# EAGLE design openv4a (EAGLE 9.5.1)
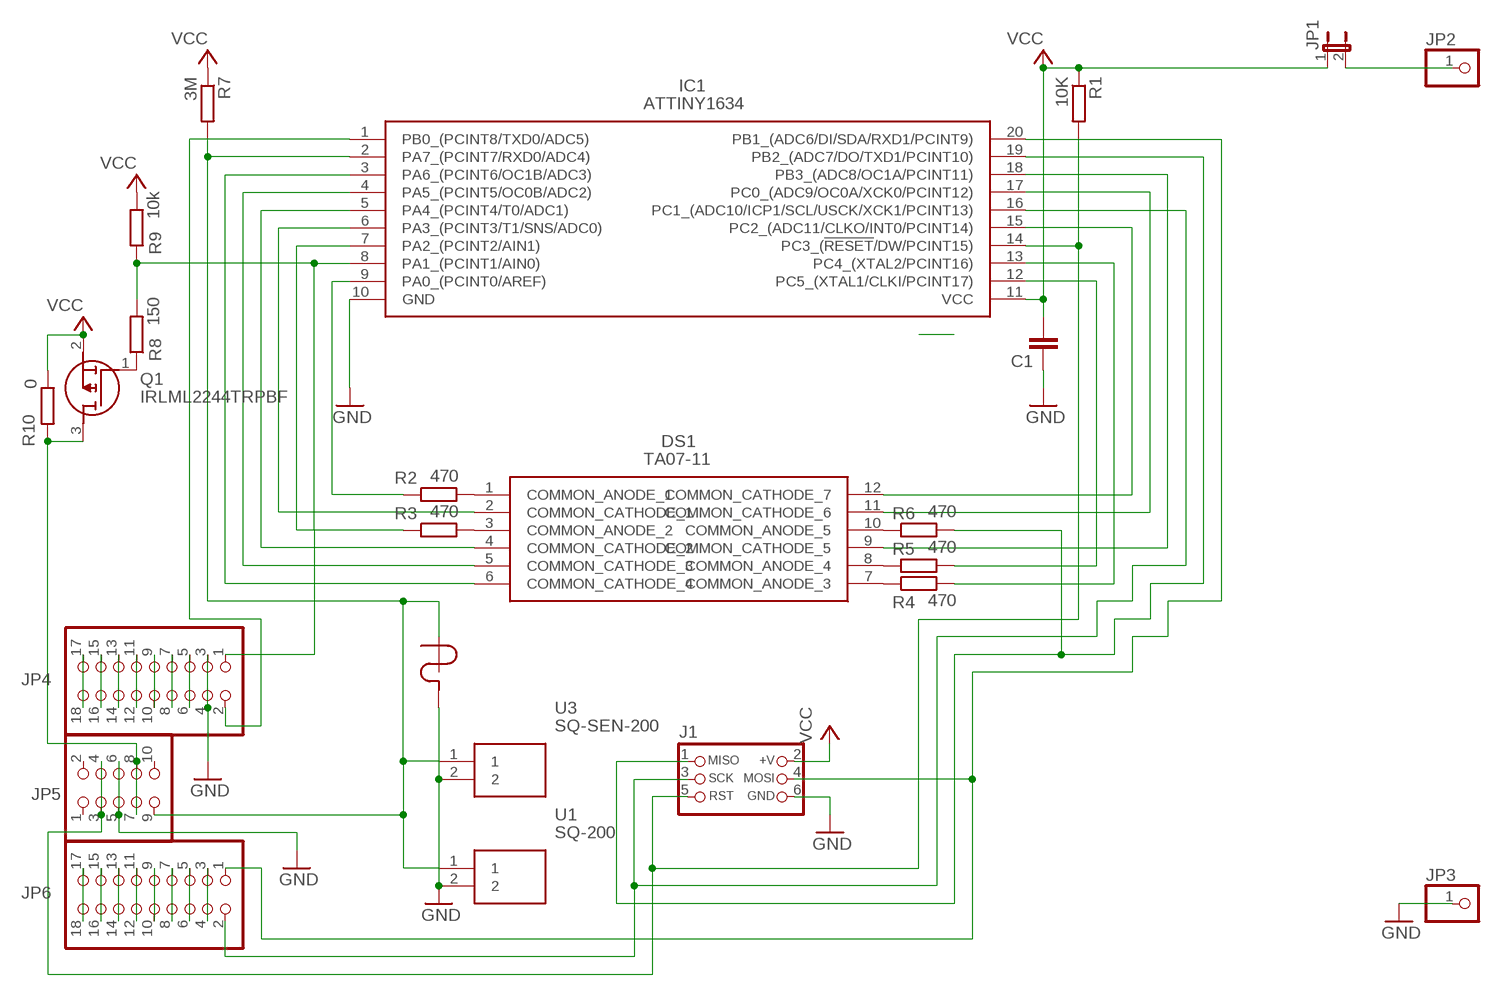
[diagram p0: schematic, sheet 1]

## Parts
C1  100nF  C-EUC0805  [C0805]
DS1  TA07-11  TA07-11EWA  [DIPS762W75P254L1778H665Q12N]
IC1  ATTINY1634  ATTINY1634R-SU  [SOIC127P1032X265-20N]
J1  CON_HEADER_PRG_AVR_ICSP-PTH  [HEADER_PRG_2X03]
JP1  JP1E  [JP1]
JP2  PINHD-1X1  [1X01]
JP3  PINHD-1X1  [1X01]
JP4  PINHD-2X9  [2X09]
JP5  PINHD-2X5  [2X05]
JP6  PINHD-2X9  [2X09]
Q1  IRLML2244TRPBF  [SOT95P237X112-3N]
R1  10K  R-EU_R0805  [R0805]
R2  470  R-EU_R0805  [R0805]
R3  470  R-EU_R0805  [R0805]
R4  470  R-EU_R0805  [R0805]
R5  470  R-EU_R0805  [R0805]
R6  470  R-EU_R0805  [R0805]
R7  3M  R-EU_R0805  [R0805]
R8  150  R-EU_R0805  [R0805]
R9  10k  R-EU_R0805  [R0805]
R10  0  R-EU_R0805  [R0805]
U1  SQ-200  SQ-MIN-200  [SQMIN200]
U2  VIB-SENS  VIBRATION-SENSOR-SIDE  [SW-18010P]
U3  SQ-SEN-200  [SQSEN200]

## Nets
GND: C1.1 IC1.10(GND) J1.6(GND) JP3.1 JP4.3 JP4.4 JP5.5 JP5.6 U1.2 U2.1 U3.2
N$2: IC1.1(PB0_(PCINT8/TXD0/ADC5)) JP4.2
N$3: JP1.2 JP2.1
N$4: DS1.1(COMMON_ANODE_1) R2.2
N$5: DS1.3(COMMON_ANODE_2) R3.2
N$6: DS1.7(COMMON_ANODE_3) R4.1
N$7: DS1.8(COMMON_ANODE_4) R5.1
N$8: DS1.10(COMMON_ANODE_5) R6.1
N$9: IC1.9(PA0_(PCINT0/AREF)) R2.1
N$10: IC1.8(PA1_(PCINT1/AIN0)) JP4.1 R8.2 R9.1
N$11: IC1.7(PA2_(PCINT2/AIN1)) R3.1
N$12: IC1.12(PC5_(XTAL1/CLKI/PCINT17)) R5.2
N$13: IC1.13(PC4_(XTAL2/PCINT16)) R4.2
N$14: DS1.2(COMMON_CATHODE_1) IC1.6(PA3_(PCINT3/T1/SNS/ADC0))
N$15: DS1.4(COMMON_CATHODE_2) IC1.5(PA4_(PCINT4/T0/ADC1))
N$16: DS1.5(COMMON_CATHODE_3) IC1.4(PA5_(PCINT5/OC0B/ADC2))
N$17: DS1.6(COMMON_CATHODE_4) IC1.3(PA6_(PCINT6/OC1B/ADC3))
N$18: IC1.19(PB2_(ADC7/DO/TXD1/PCINT10)) J1.1(MISO) R6.2
N$19: JP4.5 JP4.6
N$20: JP4.7 JP4.8
N$21: JP4.9 JP4.10
N$22: JP4.11 JP4.12
N$23: JP4.13 JP4.14
N$24: JP4.15 JP4.16
N$25: JP4.17 JP4.18
N$26: JP6.3 JP6.4
N$27: JP6.5 JP6.6
N$28: JP6.7 JP6.8
N$29: JP6.9 JP6.10
N$30: JP6.11 JP6.12
N$31: JP6.13 JP6.14
N$32: JP6.15 JP6.16
N$33: JP6.17 JP6.18
N$34: DS1.12(COMMON_CATHODE_7) IC1.15(PC2_(ADC11/CLKO/INT0/PCINT14))
N$35: DS1.11(COMMON_CATHODE_6) IC1.17(PC0_(ADC9/OC0A/XCK0/PCINT12))
N$37: IC1.16(PC1_(ADC10/ICP1/SCL/USCK/XCK1/PCINT13)) J1.3(SCK) JP6.2
N$38: Q1.1(G) R8.1
N$39: IC1.20(PB1_(ADC6/DI/SDA/RXD1/PCINT9)) J1.4(MOSI) JP6.1
N$40: DS1.9(COMMON_CATHODE_5) IC1.18(PB3_(ADC8/OC1A/PCINT11))
N$41: IC1.2(PA7_(PCINT7/RXD0/ADC4)) JP5.9 R7.2 U1.1 U2.2 U3.1
N$42: IC1.14(PC3_(!RESET!/DW/PCINT15)) J1.5(RST) JP5.3 JP5.4 R1.2
N$44: JP5.7 JP5.8 Q1.3(D) R10.2
VCC: C1.2 IC1.11(VCC) J1.2(+V) JP1.1 Q1.2(S) R1.1 R7.1 R9.2 R10.1
Unconnected: JP5.1 JP5.2 JP5.10

## Library data of the parts
C1 = rcl:C-EU: CAPACITOR, European symbol
DS1 = TA07-11EWA:TA07-11EWA: Kingbright TA07 LED-Anzeige Punktmatrix, 7 x 5 Punkte, Rot, Zeichenhhe 17.2mm 8,2 mcd 5 x 7 627 nm Source: Datasheet <http://www.kingbrightusa.com/images/catalog/SPEC/TA07-11EWA.pdf>; DESCRIPTION: Kingbright TA07 LED-Anzeige Punktmatrix, 7 x 5 Punkte, Rot, Zeichenhhe 17.2mm 8,2 mcd 5 x 7 627 nm; HEIGHT: 6.65mm; MANUFACTURER_NAME: Kingbright; MANUFACTURER_PART_NUMBER: TA07-11; MOUSER_PART_NUMBER: 604-TA07-11EWA; MOUSER_PRICE-STOCK: https://www.mouser.co.uk/ProductDetail/Kingbright/TA07-11EWA?qs=58z0TXQGVSTE7HMwS%2Fsauw%3D%3D
IC1 = ATTINY1634R-SU:ATTINY1634R-SU: Microchip ATTINY1634R-SU, 8bit AVR Microcontroller, 12MHz, 16 kB, 256 B Flash, 20-Pin SOIC Source: Datasheet <http://ww1.microchip.com/downloads/en/DeviceDoc/Atmel-8303-8-bit-AVR-Microcontroller-tinyAVR-ATtiny1634_Datasheet.pdf>; ARROW_PART_NUMBER: ATTINY1634R-SU; ARROW_PRICE-STOCK: https://www.arrow.com/en/products/attiny1634r-su/microchip-technology; DESCRIPTION: Microchip ATTINY1634R-SU, 8bit AVR Microcontroller, 12MHz, 16 kB, 256 B Flash, 20-Pin SOIC; HEIGHT: 2.65mm; MANUFACTURER_NAME: Microchip; MANUFACTURER_PART_NUMBER: ATTINY1634R-SU; MOUSER_PART_NUMBER: 556-ATTINY1634R-SU; MOUSER_PRICE-STOCK: https://www.mouser.co.uk/ProductDetail/Microchip-Technology-Atmel/ATTINY1634R-SU/?qs=TI%2F9gtmDCEGadIEQCaBqpA%3D%3D
J1 = dp_devices:CON_HEADER_PRG_AVR_ICSP: 2x3 AVR ICSP programming header
JP1 = jumper:JP1E: JUMPER
JP2 JP3 = pinhead:PINHD-1X1: PIN HEADER
JP4 JP6 = pinhead:PINHD-2X9: PIN HEADER
JP5 = pinhead:PINHD-2X5: PIN HEADER
Q1 = IRLML2244TRPBF:IRLML2244TRPBF: INFINEON - IRLML2244TRPBF - P CHANNEL POWER MOSFET, HEXFET, -20V, -4.3A, SOT-23 Source: Datasheet; DESCRIPTION: INFINEON - IRLML2244TRPBF - P CHANNEL POWER MOSFET, HEXFET, -20V, -4.3A, SOT-23; HEIGHT: 1.12mm; MANUFACTURER_NAME: Infineon; MANUFACTURER_PART_NUMBER: IRLML2244TRPBF; MOUSER_PART_NUMBER: 942-IRLML2244TRPBF; MOUSER_PRICE-STOCK: https://www.mouser.co.uk/ProductDetail/Infineon-IR/IRLML2244TRPBF/?qs=9%252BKlkBgLFf2tCL30qYbaQQ%3D%3D
R1-R10 = rcl:R-EU_: RESISTOR, European symbol
U1 = SQ-MIN-200:SQ-MIN-200: NANO-POWER TILT AND VIBRATION SENSOR Source: Datasheet <https://signalquest.com/download/Tilt and Vibration Sensor SQ-MIN-200.pdf>; DESCRIPTION: NANO-POWER TILT AND VIBRATION SENSOR; HEIGHT: 2.05mm; MANUFACTURER_NAME: SignalQuest; MANUFACTURER_PART_NUMBER: SQ-MIN-200
U2 = Supernode-Sensors:VIBRATION-SENSOR
U3 = SQ-SEN-200:SQ-SEN-200: NANO-POWER TILT AND VIBRATION SENSOR Source: Datasheet <https://signalquest.com/product/components/sq-sen-200/>; DESCRIPTION: NANO-POWER TILT AND VIBRATION SENSOR; HEIGHT: 3.4mm; MANUFACTURER_NAME: SignalQuest; MANUFACTURER_PART_NUMBER: SQ-SEN-200

## Board
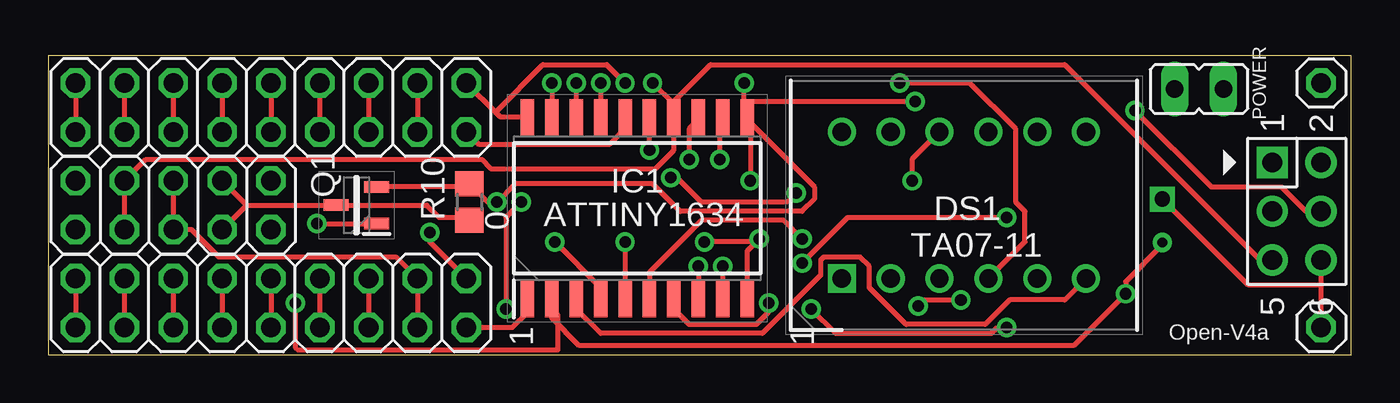
[diagram p1: board, top side]
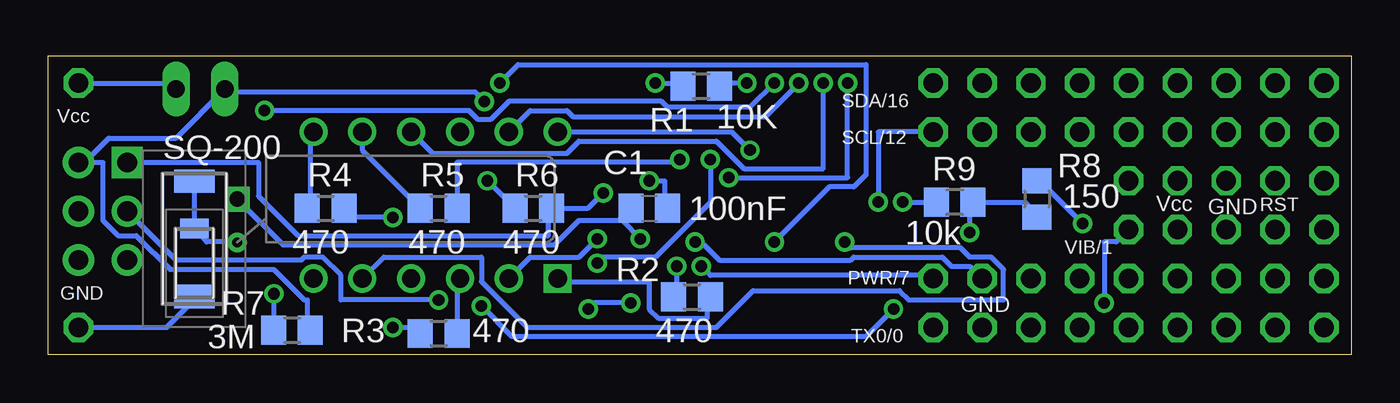
[diagram p2: board, bottom side, seen from below]

Size 67.77 x 15.55 mm. Coordinates in mm from the lower left corner, seen from the top.
Outline: 0,0 67.77,0 67.77,15.55 0,15.55 0,0
Copper layers (1*16): Top 0.035mm / dielectric 1.5mm / Bottom 0.035mm
Design rules "default *": minimum track width 10mil, minimum drill 0.6mm, track to track 8mil, track to pad 8mil, pad to pad 8mil, via to via 8mil, smd to smd 8mil, copper to edge 5mil, drill to drill 8mil, minimum pad ring 10mil, minimum via ring 8mil, stop-mask expansion 4mil, vias tented up to drill 0mil, thermal gap 10mil

### Footprints (pad centres in the part's own frame; a part is rotated, then mirrored left to right if it is on the bottom)
C0805 = smd 1.3 x 1.5: 1 -0.95,0; 2 0.95,0
DIPS762W75P254L1778H665Q12N = drill 0.95 pad 1.425 square: 1 0,0 | drill 0.95 pad 1.425: 2 0,-2.54; 3 0,-5.08; 4 0,-7.62; 5 0,-10.16; 6 0,-12.7; 7 7.62,-12.7; 8 7.62,-10.16; 9 7.62,-7.62; 10 7.62,-5.08; 11 7.62,-2.54; 12 7.62,0
SOIC127P1032X265-20N = smd 1.925 x 0.7: 1 -4.712,5.715; 2 -4.712,4.445; 3 -4.712,3.175; 4 -4.712,1.905; 5 -4.712,0.635; 6 -4.712,-0.635; 7 -4.712,-1.905; 8 -4.712,-3.175; 9 -4.712,-4.445; 10 -4.712,-5.715; 11 4.712,-5.715; 12 4.712,-4.445; 13 4.712,-3.175; 14 4.712,-1.905; 15 4.712,-0.635; 16 4.712,0.635; 17 4.712,1.905; 18 4.712,3.175; 19 4.712,4.445; 20 4.712,5.715
HEADER_PRG_2X03 = drill 1.02 pad 1.632 square: 1 -2.54,-1.27 | drill 1.02 pad 1.632: 2 -2.54,1.27; 3 0,-1.27; 4 0,1.27; 5 2.54,-1.27; 6 2.54,1.27
JP1 = drill 0.914 long: 1 0,-1.27; 2 0,1.27
1X01 = drill 1.016 octagon: 1 0,0
2X09 = drill 1.016 octagon: 1 -10.16,-1.27; 2 -10.16,1.27; 3 -7.62,-1.27; 4 -7.62,1.27; 5 -5.08,-1.27; 6 -5.08,1.27; 7 -2.54,-1.27; 8 -2.54,1.27; 9 0,-1.27; 10 0,1.27; 11 2.54,-1.27; 12 2.54,1.27; 13 5.08,-1.27; 14 5.08,1.27; 15 7.62,-1.27; 16 7.62,1.27; 17 10.16,-1.27; 18 10.16,1.27
2X05 = drill 1.016 octagon: 1 -5.08,-1.27; 2 -5.08,1.27; 3 -2.54,-1.27; 4 -2.54,1.27; 5 0,-1.27; 6 0,1.27; 7 2.54,-1.27; 8 2.54,1.27; 9 5.08,-1.27; 10 5.08,1.27
SOT95P237X112-3N = smd 1.3 x 0.6: 1 -1.05,0.95; 2 -1.05,-0.95; 3 1.05,0
R0805 = smd 1.3 x 1.5: 1 -0.95,0; 2 0.95,0
SQMIN200 = smd 1 x 1.5: 1 -1.8,0; 2 1.8,0
SW-18010P = drill 0.8 square: 1 0,0 | drill 0.5: 2 2.25,0
SQSEN200 = smd 1.2 x 2.1: 1 -3,0; 2 3,0

### Placement (x,y rotation side)
C1  36.51,7.62 0 bottom
DS1  41.27,3.97 90 top
IC1  30.64,7.62 90 top
J1  64.93,7.46 270 top
JP1  59.85,13.81 270 top
JP2  66.2,14.13 0 top
JP3  66.2,1.43 0 top
JP4  11.59,2.7 180 top
JP5  6.51,7.78 0 top
JP6  11.59,12.86 180 top
Q1  16.03,7.78 180 top
R1  33.81,13.97 0 bottom
R2  34.29,3.02 0 bottom
R3  47.47,1.11 0 bottom
R4  53.34,7.62 0 bottom
R5  47.47,7.62 0 bottom
R6  42.54,7.62 0 bottom
R7  55.09,1.27 180 bottom
R8  16.35,8.1 270 bottom
R9  20.64,7.94 180 bottom
R10  21.91,7.94 270 top
U1  60.17,4.76 270 bottom
U2  57.94,8.1 270 bottom
U3  60.17,6.03 270 bottom

### Tracks (layer width: path | path; a pad name or v marks a point on that pad's centre or on a via)
GND  (via drill 0.6)
  Top 0.254: JP5.6 JP5.5 7.46,6.51 8.89,5.08 18.1,5.08 JP4.3 JP4.4 | JP3.1 66.2,3.65 | 66.2,3.65 J1.6 | IC1.10 36.35,3.02 36.35,5.4 v36.99,6.03 36.67,5.87 v34.13,5.87 | 66.2,3.65 62.39,3.65 U2.1
  Bottom 0.254: U3.2 60.17,3.02 U1.2 60.17,2.86 61.59,1.43 JP3.1 | U2.1 55.56,5.71 41.43,5.71 40.16,6.98 38.1,6.98 C1.1 37.94,6.98 v36.99,6.03 | JP4.3 19.84,4.6 20.8,4.6 21.27,5.08 25.88,5.08 26.03,4.92 32.86,4.92 33.81,5.87 v34.13,5.87
N$2
  Top 0.254: JP4.2 24.13,1.43 24.92,2.22 24.92,2.86 IC1.1
N$3
  Bottom 0.254: JP1.2 61.44,14.13 JP2.1
N$4
  Bottom 0.254: DS1.1 41.12,3.81 36.51,3.81 36.51,2.38 36.04,1.9 33.5,1.9 33.5,3.02 R2.2
N$5
  Bottom 0.254: DS1.3 46.51,3.97 R3.2
N$6
  Bottom 0.254: DS1.7 54.13,11.59 54.13,7.62 R4.1
N$7
  Bottom 0.254: DS1.8 51.43,10.64 R5.1
N$8  (via drill 0.6)
  Top 0.254: v44.93,9.05 44.93,10.16 DS1.10
  Bottom 0.254: v44.93,9.05 R6.1
N$9  (via drill 0.6)
  Top 0.254: v35.08,4.6 35.08,3.02 IC1.9
  Bottom 0.254: v35.08,4.6 35.08,3.02 R2.1
N$10  (via drill 0.6)
  Top 0.254: v33.81,4.6 33.81,3.02 IC1.8 | v19.84,6.35 19.84,5.87 JP4.1
  Bottom 0.254: R8.2 16.35,7.3 16.99,7.94 R9.1 19.84,7.94 v19.84,6.35 | v33.81,4.6 33.34,4.13 21.91,4.13 JP4.1
N$11  (via drill 0.6)
  Top 0.254: v49.85,1.43 49.37,1.43 49.05,1.11 40.96,1.11 v39.69,2.38 | v37.46,2.7 37.46,2.22 36.83,1.59 33.34,1.59 32.54,2.38 32.54,2.86 IC1.7
  Bottom 0.254: v49.85,1.43 48.74,1.43 R3.1 | v39.69,2.38 39.37,2.7 v37.46,2.7
N$12  (via drill 0.6)
  Top 0.254: v34.92,10.16 34.92,12.06 35.08,12.22 IC1.12
  Bottom 0.254: v34.92,10.16 35.08,10 46.51,10 R5.2
N$13  (via drill 0.6)
  Top 0.254: v49.85,7.14 41.59,7.14 v39.21,4.76 | v33.34,10.16 33.34,11.75 33.81,12.22 IC1.13
  Bottom 0.254: v49.85,7.14 51.91,7.14 R4.2 | v39.21,4.76 38.89,5.08 36.19,5.08 33.34,7.94 v33.34,10.16
N$14  (via drill 0.6)
  Top 0.254: v39.21,6.03 38.26,6.98 33.97,6.98 31.27,4.29 31.27,3.02 IC1.6
  Bottom 0.254: v39.21,6.03 40.16,5.08 42.7,5.08 DS1.2
N$15  (via drill 0.6)
  Top 0.254: v30,5.87 30,3.02 IC1.5 | v44.29,14.13 47.94,14.13 50.32,11.75 50.32,7.94 50.8,7.46 50.8,5.87 DS1.4
  Bottom 0.254: v30,5.87 27.15,8.73 25.88,8.73 25.24,9.37 25.24,15.08 43.34,15.08 v44.29,14.13
N$16  (via drill 0.6)
  Top 0.254: v26.35,5.87 28.73,3.49 28.73,3.02 IC1.4
  Bottom 0.254: v26.35,5.87 26.03,5.56 20.32,5.56 19.84,5.08 18.73,5.08 18.1,4.44 18.1,2.86 23.02,2.86 23.49,3.33 31.11,3.33 33.02,1.43 42.86,1.43 45.24,3.81 45.24,5.08 50.32,5.08 DS1.5
N$17
  Top 0.254: DS1.6 52.86,2.86 50.01,2.86 48.74,1.59 44.61,1.59 42.7,3.49 42.7,4.6 42.23,5.08 40.32,5.08 40.16,4.92 40.16,4.13 37.15,1.11 28.73,1.11 27.46,2.38 27.46,2.86 IC1.3
N$18  (via drill 0.6)
  Top 0.254: v26.19,14.13 26.19,12.38 IC1.19 | v32.38,9.21 32.7,9.21 33.97,7.94 38.42,7.94 v38.89,8.41
  Bottom 0.254: J1.1 56.83,10 56.83,8.25 54.77,6.19 41.75,6.19 41.75,7.62 R6.2 39.69,7.62 v38.89,8.41 | v26.19,14.13 26.19,9.21 v32.38,9.21
N$19
  Top 0.254: JP4.5 JP4.6
N$20
  Top 0.254: JP4.7 JP4.8
N$21
  Top 0.254: JP4.9 JP4.10
N$22
  Top 0.254: JP4.11 JP4.12
N$23
  Top 0.254: JP4.13 JP4.14
N$24
  Top 0.254: JP4.15 JP4.16
N$25
  Top 0.254: JP4.17 JP4.18
N$26
  Top 0.254: JP6.3 JP6.4
N$27
  Top 0.254: JP6.5 JP6.6
N$28
  Top 0.254: JP6.7 JP6.8
N$29
  Top 0.254: JP6.9 JP6.10
N$30
  Top 0.254: JP6.11 JP6.12
N$31
  Top 0.254: JP6.13 JP6.14
N$32
  Top 0.254: JP6.15 JP6.16
N$33
  Top 0.254: JP6.17 JP6.18
N$34  (via drill 0.6)
  Top 0.254: v31.27,10.64 31.27,12.22 IC1.15
  Bottom 0.254: v31.27,10.64 32.23,11.59 DS1.12
N$35  (via drill 0.6)
  Top 0.254: v28.73,14.13 28.73,12.38 IC1.17
  Bottom 0.254: v28.73,14.13 30.48,12.38 40.48,12.38 40.8,12.7 42.7,12.7 DS1.11
N$37  (via drill 0.6)
  Top 0.254: JP6.2 22.38,10.95 29.21,10.95 30,11.75 30,12.22 IC1.16 | v47.47,2.86 45.56,2.86 v45.24,2.54 | v23.81,2.38 23.81,7.14 v24.61,7.94
  Bottom 0.254: J1.3 61.12,4.92 54.61,4.92 54.45,5.08 53.5,5.08 52.55,4.13 52.55,2.86 v47.47,2.86 | v45.24,2.54 43.66,0.95 25.24,0.95 v23.81,2.38 | v24.61,7.94 24.61,11.59 JP6.2
N$38  (via drill 0.6)
  Top 0.254: v13.97,6.83 16.99,6.83 Q1.1
  Bottom 0.254: v13.97,6.83 16.03,8.89 16.35,8.89 R8.1
N$39  (via drill 0.6)
  Top 0.254: JP6.1 23.26,12.62 | 23.26,12.62 23.49,12.38 24.92,12.38 IC1.20 | J1.4 65.4,7.46 64.13,8.73 60.48,8.73 v56.51,12.7 | v30,14.13 29.05,15.08 25.72,15.08 23.34,12.7 23.26,12.62
  Bottom 0.254: v56.51,12.7 45.88,12.7 45.4,12.22 44.77,12.22 43.81,13.18 35.88,13.18 35.56,12.86 31.27,12.86 v30,14.13
N$40  (via drill 0.6)
  Top 0.254: v27.46,14.13 27.46,12.38 IC1.18
  Bottom 0.254: v27.46,14.13 27.46,9.68 31.59,9.68 33.02,11.11 40.16,11.11 40.8,10.48 47.78,10.48 DS1.9
N$41  (via drill 0.6)
  Top 0.254: U2.2 57.94,5.71 56.04,3.81 v56.04,3.17 53.34,0.48 27.62,0.48 26.19,1.9 26.19,2.38 | 26.19,2.38 26.19,2.86 IC1.2 | v12.86,2.7 12.86,0.38 12.99,0.25 26.51,0.25 26.51,2.06 26.19,2.38
  Bottom 0.254: U3.1 60.17,8.89 60.17,6.67 U1.1 60.17,6.51 59.53,5.87 57.94,5.87 U2.2 | v56.04,3.17 R7.2 | JP5.9 12.22,5.87 12.86,5.87 v12.86,2.7 12.86,2.54 12.7,2.54
N$42  (via drill 0.6)
  Top 0.254: v31.43,14.13 32.54,13.02 32.54,12.38 IC1.14 | IC1.14 32.54,12.22 32.54,10.64 31.59,9.68 23.02,9.68 22.54,10.16 5.08,10.16 JP5.4 JP5.3 | J1.5 63.02,4.92 52.86,15.08 34.45,15.08 32.54,13.18 IC1.14
  Bottom 0.254: v31.43,14.13 32.7,14.13 R1.2
N$44
  Top 0.254: 10.32,7.78 14.92,7.78 Q1.3 15.08,7.78 19.68,7.78 20.32,7.14 21.91,7.14 R10.2 | JP5.8 10.32,7.78 | 10.32,7.78 JP5.7
VCC  (via drill 0.6)
  Top 0.254: Q1.2 17.14,8.73 21.91,8.73 R10.1 22.86,7.94 v23.34,7.94 24.29,8.89 31.43,8.89 32.86,7.46 39.21,7.46 39.85,8.1 39.85,8.73 36.51,12.06 | 36.51,12.06 v36.51,9.05 | 36.51,12.06 36.35,12.22 IC1.11 | 36.19,13.18 36.19,12.54 36.35,12.38 IC1.11 | 36.19,13.18 v36.19,14.13 | 36.51,12.06 IC1.11 | 36.19,13.18 v45.08,13.18 | 36.19,13.18 IC1.11
  Bottom 0.254: 65.88,10 J1.2 65.88,10 | 65.88,10 64.93,10 64.93,6.98 64.13,6.19 63.18,6.19 61.44,4.44 56.04,4.44 54.45,2.86 54.29,2.86 54.29,1.27 R7.1 | 65.88,10 64.61,11.27 61.12,11.27 JP1.1 58.58,13.65 45.56,13.65 v45.08,13.18 | v23.34,7.94 R9.2 | v36.51,9.05 35.72,9.05 35.72,7.62 C1.2 | v36.19,14.13 34.92,14.13 R1.1

### Text on the board
tPlace: 1 | 1
tNames: POWER | Open-V4a
bNames: SDA/16 | Vcc | SCL/12 | RST | GND | Vcc | VIB/1 | PWR/7 | GND | GND | TX0/0